# EAGLE design TripleWing (EAGLE 6.4)
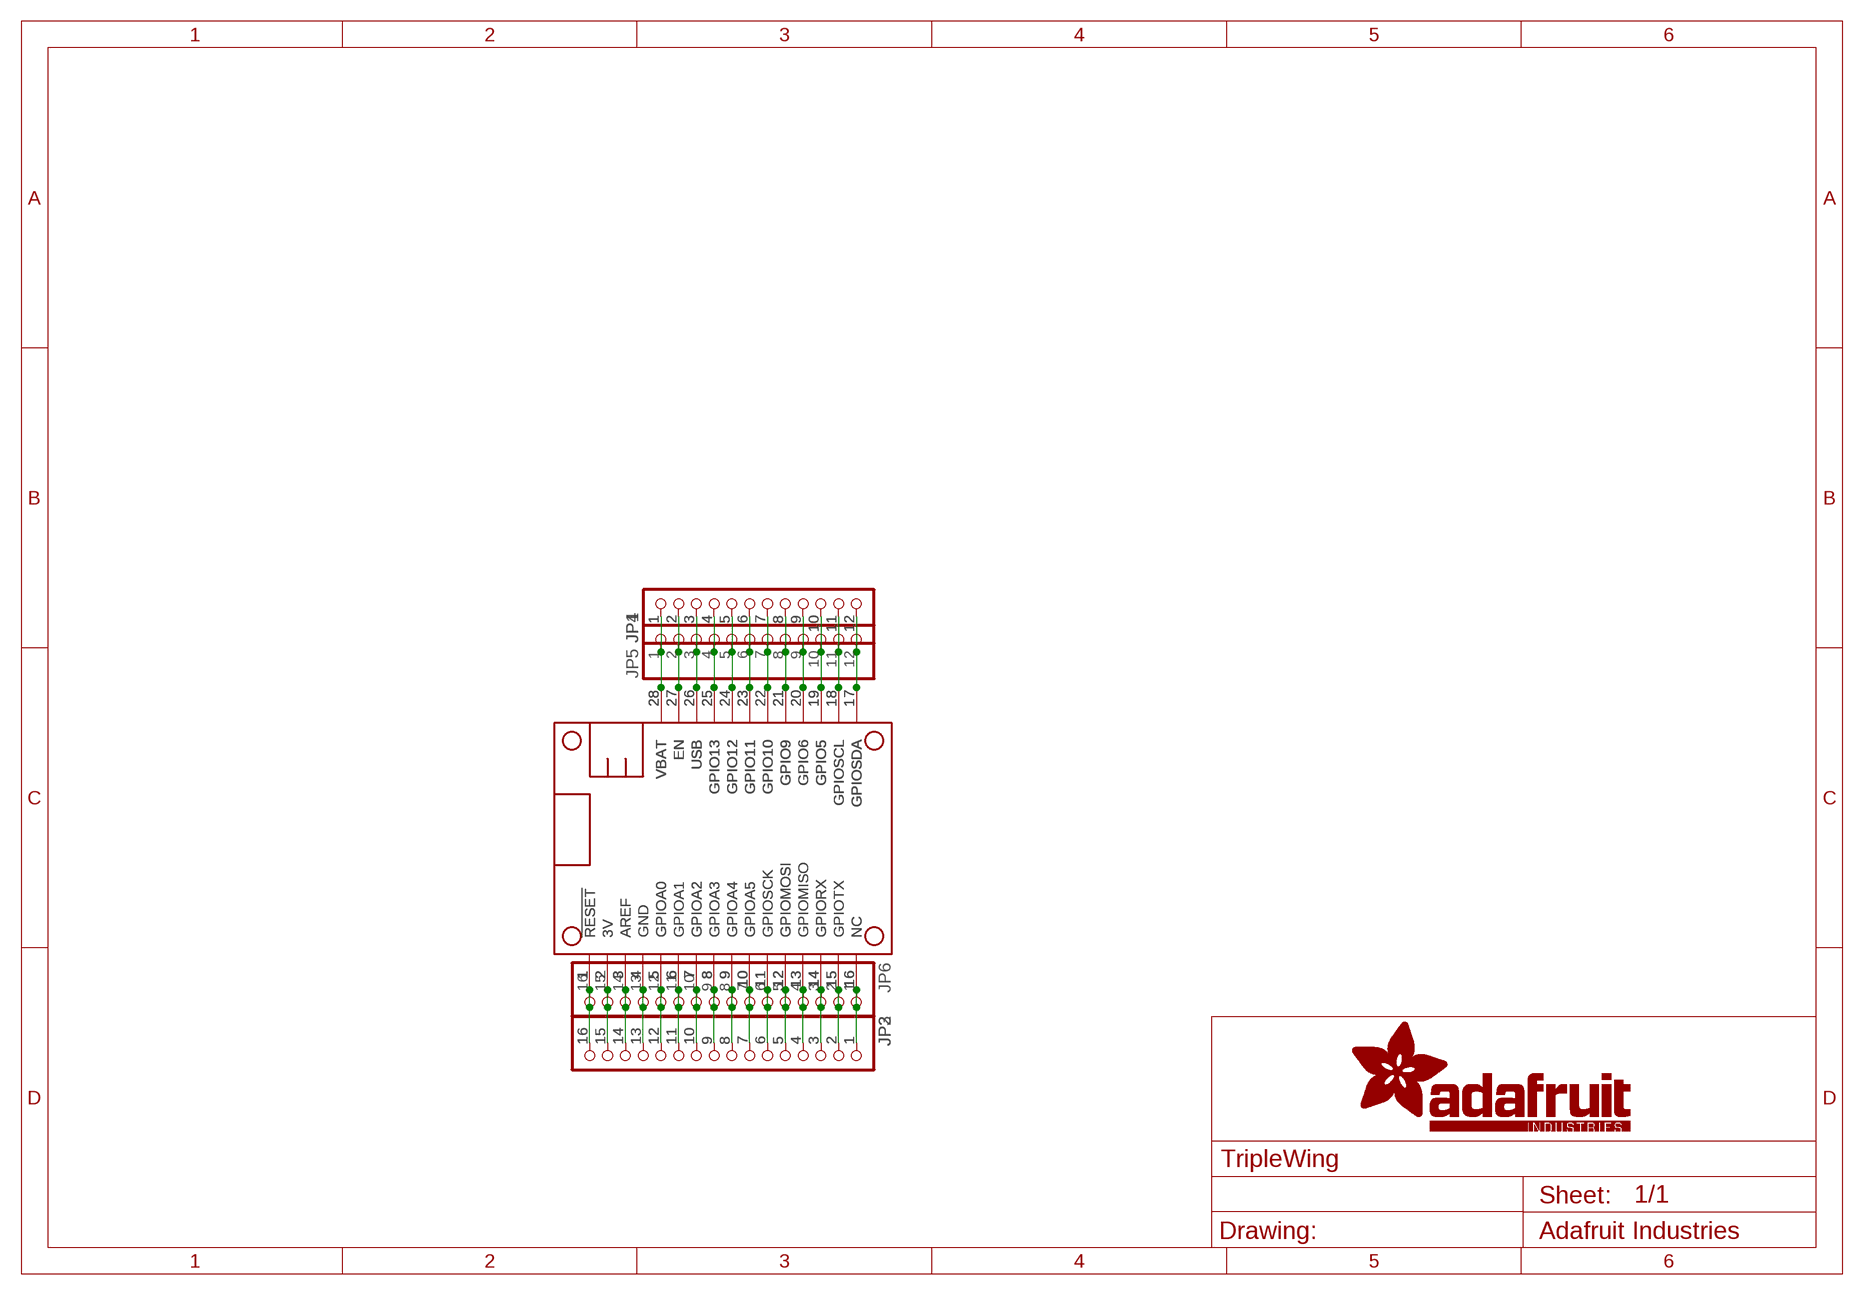
[diagram p0: schematic, sheet 1]

## Parts
JP1  HEADER-1X1276MIL  [1X12_ROUND_76MIL]
JP2  HEADER-1X16_76MIL  [1X16_ROUND_76MIL]
JP3  HEADER-1X16_76MIL  [1X16_ROUND_76MIL]
JP4  HEADER-1X1276MIL  [1X12_ROUND_76MIL]
JP5  HEADER-1X1276MIL  [1X12_ROUND_76MIL]
JP6  HEADER-1X16_76MIL  [1X16_ROUND_76MIL]
MS1  FEATHERWING_NODIM  [FEATHERWING_DIM]
MS2  FEATHERWING_NODIM  [FEATHERWING_DIM]
MS3  FEATHERWING_NODIM  [FEATHERWING_DIM]

## Nets
3V: JP2.15 JP3.15 JP6.15 MS1.2(3V) MS2.2(3V) MS3.2(3V)
A: JP2.12 JP3.12 JP6.12 MS1.5(GPIOA0) MS2.5(GPIOA0) MS3.5(GPIOA0)
AREF: JP2.14 JP3.14 JP6.14 MS1.3(AREF) MS2.3(AREF) MS3.3(AREF)
B: JP2.11 JP3.11 JP6.11 MS1.6(GPIOA1) MS2.6(GPIOA1) MS3.6(GPIOA1)
C: JP2.10 JP3.10 JP6.10 MS1.7(GPIOA2) MS2.7(GPIOA2) MS3.7(GPIOA2)
D: JP2.9 JP3.9 JP6.9 MS1.8(GPIOA3) MS2.8(GPIOA3) MS3.8(GPIOA3)
E: JP2.8 JP3.8 JP6.8 MS1.9(GPIOA4) MS2.9(GPIOA4) MS3.9(GPIOA4)
EN: JP1.2 JP4.2 JP5.2 MS1.27(EN) MS2.27(EN) MS3.27(EN)
F: JP2.7 JP3.7 JP6.7 MS1.10(GPIOA5) MS2.10(GPIOA5) MS3.10(GPIOA5)
G: JP2.1 JP3.1 JP6.1 MS1.16(NC) MS2.16(NC) MS3.16(NC)
GND: JP2.13 JP3.13 JP6.13 MS1.4(GND) MS2.4(GND) MS3.4(GND)
I: JP1.9 JP4.9 JP5.9 MS1.20(GPIO6) MS2.20(GPIO6) MS3.20(GPIO6)
J: JP1.10 JP4.10 JP5.10 MS1.19(GPIO5) MS2.19(GPIO5) MS3.19(GPIO5)
K: JP1.8 JP4.8 JP5.8 MS1.21(GPIO9) MS2.21(GPIO9) MS3.21(GPIO9)
L: JP1.7 JP4.7 JP5.7 MS1.22(GPIO10) MS2.22(GPIO10) MS3.22(GPIO10)
M: JP1.6 JP4.6 JP5.6 MS1.23(GPIO11) MS2.23(GPIO11) MS3.23(GPIO11)
MISO: JP2.4 JP3.4 JP6.4 MS1.13(GPIOMISO) MS2.13(GPIOMISO) MS3.13(GPIOMISO)
MOSI: JP2.5 JP3.5 JP6.5 MS1.12(GPIOMOSI) MS2.12(GPIOMOSI) MS3.12(GPIOMOSI)
N: JP1.5 JP4.5 JP5.5 MS1.24(GPIO12) MS2.24(GPIO12) MS3.24(GPIO12)
O: JP1.4 JP4.4 JP5.4 MS1.25(GPIO13) MS2.25(GPIO13) MS3.25(GPIO13)
RESET: JP2.16 JP3.16 JP6.16 MS1.1(!RESET) MS2.1(!RESET) MS3.1(!RESET)
RX: JP2.3 JP3.3 JP6.3 MS1.14(GPIORX) MS2.14(GPIORX) MS3.14(GPIORX)
SCK: JP2.6 JP3.6 JP6.6 MS1.11(GPIOSCK) MS2.11(GPIOSCK) MS3.11(GPIOSCK)
SCL: JP1.11 JP4.11 JP5.11 MS1.18(GPIOSCL) MS2.18(GPIOSCL) MS3.18(GPIOSCL)
SDA: JP1.12 JP4.12 JP5.12 MS1.17(GPIOSDA) MS2.17(GPIOSDA) MS3.17(GPIOSDA)
TX: JP2.2 JP3.2 JP6.2 MS1.15(GPIOTX) MS2.15(GPIOTX) MS3.15(GPIOTX)
USB: JP1.3 JP4.3 JP5.3 MS1.26(USB) MS2.26(USB) MS3.26(USB)
VBAT: JP1.1 JP4.1 JP5.1 MS1.28(VBAT) MS2.28(VBAT) MS3.28(VBAT)

## Library data of the parts
JP1 JP4 JP5 = microbuilder:HEADER-1X12
JP2 JP3 JP6 = microbuilder:HEADER-1X16: PIN HEADER
MS1-MS3 = microbuilder:FEATHERWING

## Board
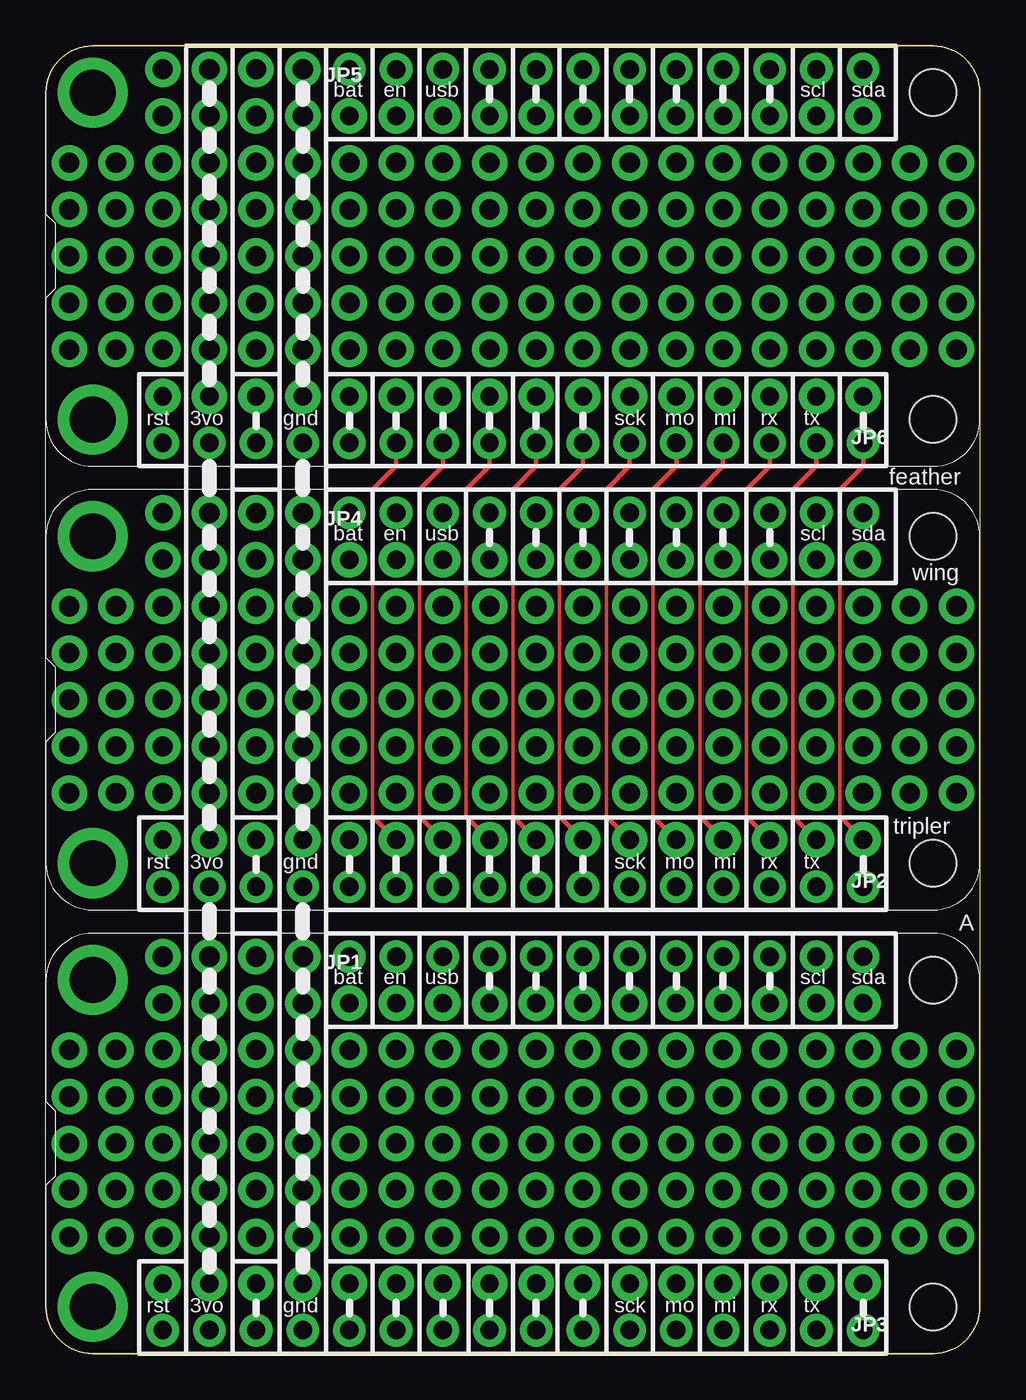
[diagram p1: board, top side]
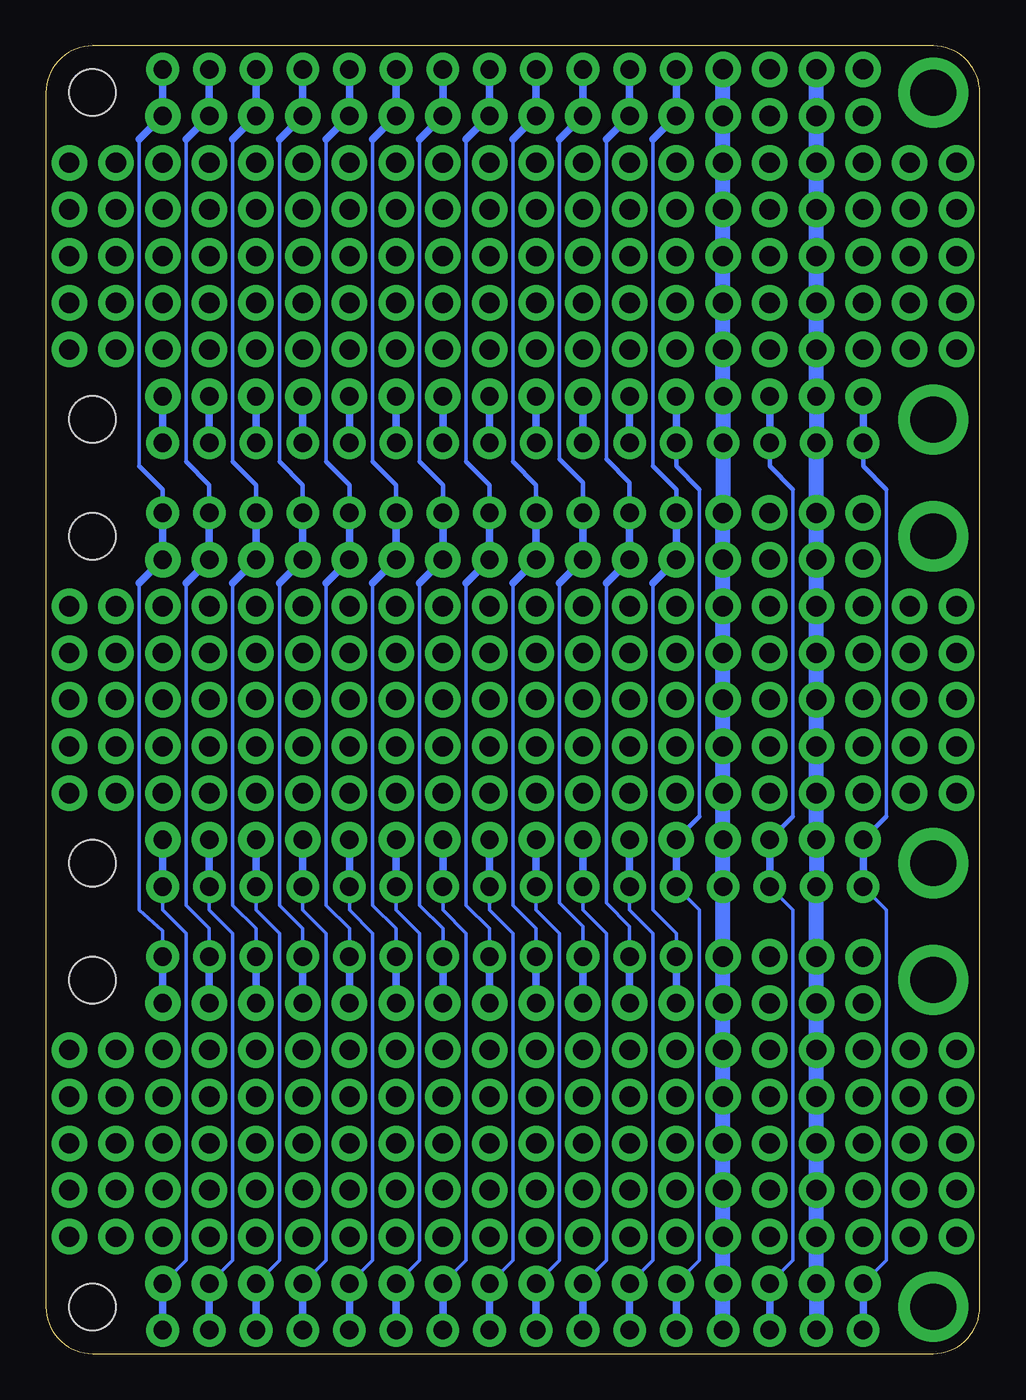
[diagram p2: board, bottom side, seen from below]

Size 50.8 x 71.12 mm. Coordinates in mm from the lower left corner, seen from the top.
Outline: 0,2.54 0,68.58 arc-90 2.54,71.12 48.26,71.12 arc-90 50.8,68.58 50.8,2.54 arc-90 48.26,0 2.54,0 arc-90 0,2.54
Copper layers (1*16): Top 0.035mm / dielectric 1.5mm / Bottom 0.035mm
Design rules "adafruit": minimum track width 8mil, minimum drill 15.5mil, track to track 8mil, track to pad 8mil, pad to pad 8mil, via to via 8mil, smd to smd 8mil, copper to edge 10mil, drill to drill 8mil, minimum pad ring 10mil, minimum via ring 8mil, stop-mask expansion 2mil, vias tented up to drill 20mil, thermal gap 10mil

### Footprints (pad centres in the part's own frame; a part is rotated, then mirrored left to right if it is on the bottom)
1X12_ROUND_76MIL = drill 1 pad 1.93: 1 -13.97,0; 2 -11.43,0; 3 -8.89,0; 4 -6.35,0; 5 -3.81,0; 6 -1.27,0; 7 1.27,0; 8 3.81,0; 9 6.35,0; 10 8.89,0; 11 11.43,0; 12 13.97,0
1X16_ROUND_76MIL = drill 1 pad 1.93: 1 -19.05,0; 2 -16.51,0; 3 -13.97,0; 4 -11.43,0; 5 -8.89,0; 6 -6.35,0; 7 -3.81,0; 8 -1.27,0; 9 1.27,0; 10 3.81,0; 11 6.35,0; 12 8.89,0; 13 11.43,0; 14 13.97,0; 15 16.51,0; 16 19.05,0
FEATHERWING_DIM = drill 1 pad 1.778: 1 6.35,1.27; 2 8.89,1.27; 3 11.43,1.27; 4 13.97,1.27; 5 16.51,1.27; 6 19.05,1.27; 7 21.59,1.27; 8 24.13,1.27; 9 26.67,1.27; 10 29.21,1.27; 11 31.75,1.27; 12 34.29,1.27; 13 36.83,1.27; 14 39.37,1.27; 15 41.91,1.27; 16 44.45,1.27; 17 44.45,21.59; 18 41.91,21.59; 19 39.37,21.59; 20 36.83,21.59; 21 34.29,21.59; 22 31.75,21.59; 23 29.21,21.59; 24 26.67,21.59; 25 24.13,21.59; 26 21.59,21.59; 27 19.05,21.59; 28 16.51,21.59 | drill 2.5 pad 3.81: P$1 2.54,20.32; P$2 2.54,2.54 | hole 2.54: 48.26,20.32; 48.26,2.54

### Placement (x,y rotation side)
JP1  30.48,19.05 0 top
JP2  25.4,27.94 180 top
JP3  25.4,3.81 180 top
JP4  30.48,43.18 0 top
JP5  30.48,67.31 0 top
JP6  25.4,52.07 180 top
MS1  0,0 0 top
MS2  0,24.13 0 top
MS3  0,48.26 0 top

### Tracks (layer width: path | path; a pad name or v marks a point on that pad's centre or on a via)
3V  (via drill 1.1 pad 1.93)
  Bottom 0.813: MS1.2 JP3.15 v8.89,6.35 v8.89,8.89 v8.89,11.43 v8.89,13.97 v8.89,16.51 v8.89,19.05 v8.89,21.59 MS2.2 JP2.15 v8.89,30.48 v8.89,33.02 v8.89,35.56 v8.89,38.1 v8.89,40.64 v8.89,43.18 v8.89,45.72 MS3.2 JP6.15 v8.89,54.61 v8.89,57.15 v8.89,59.69 v8.89,62.23 v8.89,64.77 v8.89,67.31 v8.89,69.85
A
  Bottom 0.203: JP3.12 15.24,5.08 15.24,24.13 MS2.5 | 15.24,29.21 15.24,46.99
  Bottom 0.254: JP2.12 15.24,29.21 | 15.24,46.99 16.51,48.26 MS3.5
  Bottom 0.406: JP3.12 MS1.5 | JP2.12 MS2.5 | JP6.12 MS3.5
AREF
  Bottom 0.203: JP3.14 10.16,5.08 10.16,24.13 MS2.3 | 10.16,29.21 10.16,46.99
  Bottom 0.254: JP2.14 10.16,29.21 | 10.16,46.99 11.43,48.26 MS3.3
  Bottom 0.406: JP3.14 MS1.3 | JP2.14 MS2.3 | JP6.14 MS3.3
B
  Top 0.203: 17.78,29.21 17.78,46.99
  Top 0.254: JP2.11 17.78,29.21 | 17.78,46.99 19.05,48.26 MS3.6
  Bottom 0.203: JP3.11 17.78,5.08 17.78,22.86 19.05,24.13 MS2.6
  Bottom 0.406: MS1.6 JP3.11 | JP2.11 MS2.6 | JP6.11 MS3.6
C
  Top 0.203: 20.32,29.21 20.32,46.99
  Top 0.254: JP2.10 20.32,29.21 | 20.32,46.99 21.59,48.26 MS3.7
  Bottom 0.203: JP3.10 20.32,5.08 20.32,22.86 21.59,24.13 MS2.7
  Bottom 0.406: JP3.10 MS1.7 | JP2.10 MS2.7 | JP6.10 MS3.7
D
  Top 0.203: 22.86,29.21 22.86,46.99
  Top 0.254: JP2.9 22.86,29.21 | 22.86,46.99 24.13,48.26 MS3.8
  Bottom 0.203: JP3.9 22.86,5.08 22.86,22.86 24.13,24.13 MS2.8
  Bottom 0.406: MS1.8 JP3.9 | JP2.9 MS2.8 | JP6.9 MS3.8
E
  Top 0.203: 25.4,29.21 25.4,46.99
  Top 0.254: JP2.8 25.4,29.21 | 25.4,46.99 26.67,48.26 MS3.9
  Bottom 0.203: JP3.8 25.4,5.08 25.4,22.86 26.67,24.13 MS2.9
  Bottom 0.406: JP3.8 MS1.9 | JP2.8 MS2.9 | JP6.8 MS3.9
EN
  Bottom 0.203: MS1.27 19.05,23.24 20.32,24.51 20.32,41.91 | 20.32,48.64 20.32,66.04
  Bottom 0.254: 20.32,48.64 19.05,47.37 MS2.27
  Bottom 0.406: JP1.2 MS1.27 | MS2.27 JP4.2 20.32,41.91 | 20.32,66.04 JP5.2 MS3.27
F
  Top 0.203: 27.94,29.21 27.94,46.99
  Top 0.254: JP2.7 27.94,29.21 | 27.94,46.99 29.21,48.26 MS3.10
  Bottom 0.203: JP3.7 27.94,5.08 27.94,22.86 29.21,24.13 MS2.10
  Bottom 0.406: MS1.10 JP3.7 | JP2.7 MS2.10 | JP6.7 MS3.10
G
  Top 0.203: 43.18,29.21 43.18,46.99
  Top 0.254: JP2.1 43.18,29.21 | 43.18,46.99 44.45,48.26 MS3.16
  Bottom 0.203: JP3.1 43.18,5.08 43.18,22.86 44.45,24.13 MS2.16
  Bottom 0.406: JP3.1 MS1.16 | JP2.1 MS2.16 | JP6.1 MS3.16
GND  (via drill 1.1 pad 1.93)
  Bottom 0.813: MS1.4 JP3.13 v13.97,6.35 v13.97,8.89 v13.97,11.43 v13.97,13.97 v13.97,16.51 v13.97,19.05 v13.97,21.59 MS2.4 JP2.13 v13.97,30.48 v13.97,33.02 v13.97,35.56 v13.97,38.1 v13.97,40.64 v13.97,43.18 v13.97,45.72 MS3.4 JP6.13 v13.97,54.61 v13.97,57.15 v13.97,59.69 v13.97,62.23 v13.97,64.77 v13.97,67.31 v13.97,69.85
I
  Bottom 0.203: MS1.20 36.83,23.11 38.1,24.38 38.1,41.91 | 38.1,48.51 38.1,66.04
  Bottom 0.254: 38.1,48.51 36.83,47.24 MS2.20
  Bottom 0.406: MS1.20 JP1.9 | MS2.20 JP4.9 38.1,41.91 | 38.1,66.04 JP5.9 MS3.20
J
  Bottom 0.203: 39.37,21.08 MS1.19 39.37,23.11 40.64,24.38 40.64,41.91 | 40.64,48.51 40.64,66.04
  Bottom 0.254: 40.64,48.51 39.37,47.24 MS2.19
  Bottom 0.406: JP1.10 39.37,21.08 | MS2.19 JP4.10 40.64,41.91 | 40.64,66.04 JP5.10 MS3.19
K
  Bottom 0.203: MS1.21 34.29,23.11 35.56,24.38 35.56,41.91 | 35.56,48.51 35.56,66.04
  Bottom 0.254: 35.56,48.51 34.29,47.24 MS2.21
  Bottom 0.406: JP1.8 MS1.21 | MS2.21 JP4.8 35.56,41.91 | 35.56,66.04 JP5.8 MS3.21
L
  Bottom 0.203: MS1.22 31.75,23.11 33.02,24.38 33.02,41.91 | 33.02,48.51 33.02,66.04
  Bottom 0.254: 33.02,48.51 31.75,47.24 MS2.22
  Bottom 0.406: MS1.22 JP1.7 | MS2.22 JP4.7 33.02,41.91 | 33.02,66.04 JP5.7 MS3.22
M
  Bottom 0.203: MS1.23 29.21,23.11 30.48,24.38 30.48,41.91 | 30.48,48.51 30.48,66.04
  Bottom 0.254: 30.48,48.51 29.21,47.24 MS2.23
  Bottom 0.406: JP1.6 MS1.23 | MS2.23 JP4.6 30.48,41.91 | 30.48,66.04 JP5.6 MS3.23
MISO
  Top 0.203: 35.56,29.21 35.56,46.99
  Top 0.254: JP2.4 35.56,29.21 | 35.56,46.99 36.83,48.26 MS3.13
  Bottom 0.203: JP3.4 35.56,5.08 35.56,22.86 36.83,24.13 MS2.13
  Bottom 0.406: JP3.4 MS1.13 | JP2.4 MS2.13 | JP6.4 MS3.13
MOSI
  Top 0.203: 33.02,29.21 33.02,46.99
  Top 0.254: JP2.5 33.02,29.21 | 33.02,46.99 34.29,48.26 MS3.12
  Bottom 0.203: JP3.5 33.02,5.08 33.02,22.86 34.29,24.13 MS2.12
  Bottom 0.406: MS1.12 JP3.5 | JP2.5 MS2.12 | JP6.5 MS3.12
N
  Bottom 0.203: MS1.24 26.67,23.11 27.94,24.38 27.94,41.91 | 27.94,48.51 27.94,66.04
  Bottom 0.254: 27.94,48.51 26.67,47.24 MS2.24
  Bottom 0.406: MS1.24 JP1.5 | MS2.24 JP4.5 27.94,41.91 | 27.94,66.04 JP5.5 MS3.24
N$1  (via drill 1.1 pad 1.93)
  other vias: 44.45,54.61
N$2  (via drill 1.1 pad 1.93)
  other vias: 44.45,57.15
N$3  (via drill 1.1 pad 1.93)
  other vias: 44.45,59.69
N$4  (via drill 1.1 pad 1.93)
  other vias: 44.45,62.23
N$5  (via drill 1.1 pad 1.93)
  other vias: 44.45,64.77
N$6  (via drill 1.1 pad 1.93)
  other vias: 41.91,64.77
N$7  (via drill 1.1 pad 1.93)
  other vias: 41.91,62.23
N$8  (via drill 1.1 pad 1.93)
  other vias: 41.91,59.69
N$9  (via drill 1.1 pad 1.93)
  other vias: 41.91,57.15
N$10  (via drill 1.1 pad 1.93)
  other vias: 41.91,54.61
N$11  (via drill 1.1 pad 1.93)
  other vias: 46.99,54.61
N$12  (via drill 1.1 pad 1.93)
  other vias: 46.99,57.15
N$13  (via drill 1.1 pad 1.93)
  other vias: 46.99,59.69
N$14  (via drill 1.1 pad 1.93)
  other vias: 46.99,62.23
N$15  (via drill 1.1 pad 1.93)
  other vias: 46.99,64.77
N$16  (via drill 1.1 pad 1.93)
  other vias: 44.45,30.48
N$17  (via drill 1.1 pad 1.93)
  other vias: 49.53,64.77
N$18  (via drill 1.1 pad 1.93)
  other vias: 49.53,62.23
N$19  (via drill 1.1 pad 1.93)
  other vias: 49.53,59.69
N$20  (via drill 1.1 pad 1.93)
  other vias: 49.53,57.15
N$21  (via drill 1.1 pad 1.93)
  other vias: 49.53,54.61
N$22  (via drill 1.1 pad 1.93)
  other vias: 39.37,54.61
N$23  (via drill 1.1 pad 1.93)
  other vias: 39.37,57.15
N$24  (via drill 1.1 pad 1.93)
  other vias: 39.37,59.69
N$25  (via drill 1.1 pad 1.93)
  other vias: 39.37,62.23
N$26  (via drill 1.1 pad 1.93)
  other vias: 6.35,6.35
N$27  (via drill 1.1 pad 1.93)
  other vias: 44.45,33.02
N$28  (via drill 1.1 pad 1.93)
  other vias: 11.43,6.35
N$29  (via drill 1.1 pad 1.93)
  other vias: 44.45,35.56
N$30  (via drill 1.1 pad 1.93)
  other vias: 44.45,38.1
N$31  (via drill 1.1 pad 1.93)
  other vias: 11.43,8.89
N$32  (via drill 1.1 pad 1.93)
  other vias: 44.45,40.64
N$33  (via drill 1.1 pad 1.93)
  other vias: 6.35,8.89
N$34  (via drill 1.1 pad 1.93)
  other vias: 6.35,11.43
N$35  (via drill 1.1 pad 1.93)
  other vias: 41.91,40.64
N$36  (via drill 1.1 pad 1.93)
  other vias: 3.81,6.35
N$37  (via drill 1.1 pad 1.93)
  other vias: 1.27,6.35
N$38  (via drill 1.1 pad 1.93)
  other vias: 1.27,8.89
N$39  (via drill 1.1 pad 1.93)
  other vias: 3.81,8.89
N$40  (via drill 1.1 pad 1.93)
  other vias: 3.81,11.43
N$41  (via drill 1.1 pad 1.93)
  other vias: 1.27,11.43
N$42  (via drill 1.1 pad 1.93)
  other vias: 1.27,13.97
N$43  (via drill 1.1 pad 1.93)
  other vias: 3.81,13.97
N$44  (via drill 1.1 pad 1.93)
  other vias: 6.35,13.97
N$45  (via drill 1.1 pad 1.93)
  other vias: 41.91,38.1
N$46  (via drill 1.1 pad 1.93)
  other vias: 11.43,13.97
N$47  (via drill 1.1 pad 1.93)
  other vias: 11.43,11.43
N$48  (via drill 1.1 pad 1.93)
  other vias: 41.91,35.56
N$49  (via drill 1.1 pad 1.93)
  other vias: 41.91,33.02
N$50  (via drill 1.1 pad 1.93)
  other vias: 1.27,16.51
N$51  (via drill 1.1 pad 1.93)
  other vias: 3.81,16.51
N$52  (via drill 1.1 pad 1.93)
  other vias: 6.35,16.51
N$53  (via drill 1.1 pad 1.93)
  other vias: 41.91,30.48
N$54  (via drill 1.1 pad 1.93)
  other vias: 11.43,16.51
N$55  (via drill 1.1 pad 1.93)
  other vias: 46.99,30.48
N$56  (via drill 1.1 pad 1.93)
  other vias: 46.99,33.02
N$57  (via drill 1.1 pad 1.93)
  other vias: 46.99,35.56
N$58  (via drill 1.1 pad 1.93)
  other vias: 11.43,21.59
N$59  (via drill 1.1 pad 1.93)
  other vias: 11.43,19.05
N$60  (via drill 1.1 pad 1.93)
  other vias: 46.99,38.1
N$61  (via drill 1.1 pad 1.93)
  other vias: 46.99,40.64
N$62  (via drill 1.1 pad 1.93)
  other vias: 6.35,21.59
N$63  (via drill 1.1 pad 1.93)
  other vias: 6.35,19.05
N$64  (via drill 1.1 pad 1.93)
  other vias: 16.51,6.35
N$65  (via drill 1.1 pad 1.93)
  other vias: 16.51,8.89
N$66  (via drill 1.1 pad 1.93)
  other vias: 16.51,11.43
N$67  (via drill 1.1 pad 1.93)
  other vias: 16.51,13.97
N$68  (via drill 1.1 pad 1.93)
  other vias: 16.51,16.51
N$69  (via drill 1.1 pad 1.93)
  other vias: 19.05,16.51
N$70  (via drill 1.1 pad 1.93)
  other vias: 19.05,13.97
N$71  (via drill 1.1 pad 1.93)
  other vias: 19.05,11.43
N$72  (via drill 1.1 pad 1.93)
  other vias: 19.05,8.89
N$73  (via drill 1.1 pad 1.93)
  other vias: 19.05,6.35
N$74  (via drill 1.1 pad 1.93)
  other vias: 21.59,6.35
N$75  (via drill 1.1 pad 1.93)
  other vias: 21.59,8.89
N$76  (via drill 1.1 pad 1.93)
  other vias: 21.59,11.43
N$77  (via drill 1.1 pad 1.93)
  other vias: 21.59,13.97
N$78  (via drill 1.1 pad 1.93)
  other vias: 21.59,16.51
N$79  (via drill 1.1 pad 1.93)
  other vias: 24.13,16.51
N$80  (via drill 1.1 pad 1.93)
  other vias: 24.13,13.97
N$81  (via drill 1.1 pad 1.93)
  other vias: 24.13,11.43
N$82  (via drill 1.1 pad 1.93)
  other vias: 24.13,8.89
N$83  (via drill 1.1 pad 1.93)
  other vias: 24.13,6.35
N$84  (via drill 1.1 pad 1.93)
  other vias: 26.67,6.35
N$85  (via drill 1.1 pad 1.93)
  other vias: 26.67,8.89
N$86  (via drill 1.1 pad 1.93)
  other vias: 26.67,11.43
N$87  (via drill 1.1 pad 1.93)
  other vias: 26.67,13.97
N$88  (via drill 1.1 pad 1.93)
  other vias: 26.67,16.51
N$89  (via drill 1.1 pad 1.93)
  other vias: 29.21,16.51
N$90  (via drill 1.1 pad 1.93)
  other vias: 29.21,13.97
N$91  (via drill 1.1 pad 1.93)
  other vias: 29.21,11.43
N$92  (via drill 1.1 pad 1.93)
  other vias: 29.21,8.89
N$93  (via drill 1.1 pad 1.93)
  other vias: 29.21,6.35
N$94  (via drill 1.1 pad 1.93)
  other vias: 31.75,6.35
N$95  (via drill 1.1 pad 1.93)
  other vias: 34.29,6.35
N$96  (via drill 1.1 pad 1.93)
  other vias: 36.83,6.35
N$97  (via drill 1.1 pad 1.93)
  other vias: 39.37,6.35
N$98  (via drill 1.1 pad 1.93)
  other vias: 41.91,6.35
N$99  (via drill 1.1 pad 1.93)
  other vias: 41.91,8.89
N$100  (via drill 1.1 pad 1.93)
  other vias: 41.91,11.43
N$101  (via drill 1.1 pad 1.93)
  other vias: 41.91,13.97
N$102  (via drill 1.1 pad 1.93)
  other vias: 41.91,16.51
N$103  (via drill 1.1 pad 1.93)
  other vias: 39.37,16.51
N$104  (via drill 1.1 pad 1.93)
  other vias: 39.37,13.97
N$105  (via drill 1.1 pad 1.93)
  other vias: 39.37,11.43
N$106  (via drill 1.1 pad 1.93)
  other vias: 39.37,8.89
N$107  (via drill 1.1 pad 1.93)
  other vias: 36.83,8.89
N$108  (via drill 1.1 pad 1.93)
  other vias: 36.83,11.43
N$109  (via drill 1.1 pad 1.93)
  other vias: 36.83,13.97
N$110  (via drill 1.1 pad 1.93)
  other vias: 36.83,16.51
N$111  (via drill 1.1 pad 1.93)
  other vias: 34.29,16.51
N$112  (via drill 1.1 pad 1.93)
  other vias: 34.29,13.97
N$113  (via drill 1.1 pad 1.93)
  other vias: 34.29,11.43
N$114  (via drill 1.1 pad 1.93)
  other vias: 34.29,8.89
N$115  (via drill 1.1 pad 1.93)
  other vias: 31.75,8.89
N$116  (via drill 1.1 pad 1.93)
  other vias: 31.75,11.43
N$117  (via drill 1.1 pad 1.93)
  other vias: 31.75,13.97
N$118  (via drill 1.1 pad 1.93)
  other vias: 31.75,16.51
N$119  (via drill 1.1 pad 1.93)
  other vias: 44.45,16.51
N$120  (via drill 1.1 pad 1.93)
  other vias: 44.45,13.97
N$121  (via drill 1.1 pad 1.93)
  other vias: 44.45,11.43
N$122  (via drill 1.1 pad 1.93)
  other vias: 44.45,8.89
N$123  (via drill 1.1 pad 1.93)
  other vias: 44.45,6.35
N$124  (via drill 1.1 pad 1.93)
  other vias: 46.99,6.35
N$125  (via drill 1.1 pad 1.93)
  other vias: 49.53,6.35
N$126  (via drill 1.1 pad 1.93)
  other vias: 49.53,8.89
N$127  (via drill 1.1 pad 1.93)
  other vias: 46.99,8.89
N$128  (via drill 1.1 pad 1.93)
  other vias: 46.99,11.43
N$129  (via drill 1.1 pad 1.93)
  other vias: 49.53,11.43
N$130  (via drill 1.1 pad 1.93)
  other vias: 49.53,13.97
N$131  (via drill 1.1 pad 1.93)
  other vias: 46.99,13.97
N$132  (via drill 1.1 pad 1.93)
  other vias: 46.99,16.51
N$133  (via drill 1.1 pad 1.93)
  other vias: 49.53,16.51
N$134  (via drill 1.1 pad 1.93)
  other vias: 49.53,40.64
N$135  (via drill 1.1 pad 1.93)
  other vias: 49.53,38.1
N$136  (via drill 1.1 pad 1.93)
  other vias: 49.53,35.56
N$137  (via drill 1.1 pad 1.93)
  other vias: 49.53,33.02
N$138  (via drill 1.1 pad 1.93)
  other vias: 49.53,30.48
N$139  (via drill 1.1 pad 1.93)
  other vias: 39.37,30.48
N$140  (via drill 1.1 pad 1.93)
  other vias: 39.37,33.02
N$141  (via drill 1.1 pad 1.93)
  other vias: 39.37,35.56
N$142  (via drill 1.1 pad 1.93)
  other vias: 39.37,38.1
N$143  (via drill 1.1 pad 1.93)
  other vias: 39.37,40.64
N$144  (via drill 1.1 pad 1.93)
  other vias: 36.83,40.64
N$145  (via drill 1.1 pad 1.93)
  other vias: 36.83,38.1
N$146  (via drill 1.1 pad 1.93)
  other vias: 36.83,35.56
N$147  (via drill 1.1 pad 1.93)
  other vias: 36.83,33.02
N$148  (via drill 1.1 pad 1.93)
  other vias: 36.83,30.48
N$149  (via drill 1.1 pad 1.93)
  other vias: 34.29,30.48
N$150  (via drill 1.1 pad 1.93)
  other vias: 34.29,33.02
N$151  (via drill 1.1 pad 1.93)
  other vias: 34.29,35.56
N$152  (via drill 1.1 pad 1.93)
  other vias: 34.29,38.1
N$153  (via drill 1.1 pad 1.93)
  other vias: 34.29,40.64
N$154  (via drill 1.1 pad 1.93)
  other vias: 31.75,40.64
N$155  (via drill 1.1 pad 1.93)
  other vias: 31.75,38.1
N$156  (via drill 1.1 pad 1.93)
  other vias: 31.75,35.56
N$157  (via drill 1.1 pad 1.93)
  other vias: 31.75,33.02
N$158  (via drill 1.1 pad 1.93)
  other vias: 31.75,30.48
N$159  (via drill 1.1 pad 1.93)
  other vias: 29.21,30.48
N$160  (via drill 1.1 pad 1.93)
  other vias: 29.21,33.02
N$161  (via drill 1.1 pad 1.93)
  other vias: 29.21,35.56
N$162  (via drill 1.1 pad 1.93)
  other vias: 29.21,38.1
N$163  (via drill 1.1 pad 1.93)
  other vias: 29.21,40.64
N$164  (via drill 1.1 pad 1.93)
  other vias: 26.67,40.64
N$165  (via drill 1.1 pad 1.93)
  other vias: 26.67,38.1
N$166  (via drill 1.1 pad 1.93)
  other vias: 26.67,35.56
N$167  (via drill 1.1 pad 1.93)
  other vias: 26.67,33.02
N$168  (via drill 1.1 pad 1.93)
  other vias: 26.67,30.48
N$169  (via drill 1.1 pad 1.93)
  other vias: 24.13,30.48
N$170  (via drill 1.1 pad 1.93)
  other vias: 24.13,33.02
N$171  (via drill 1.1 pad 1.93)
  other vias: 24.13,35.56
N$172  (via drill 1.1 pad 1.93)
  other vias: 24.13,38.1
N$173  (via drill 1.1 pad 1.93)
  other vias: 24.13,40.64
N$174  (via drill 1.1 pad 1.93)
  other vias: 21.59,40.64
N$175  (via drill 1.1 pad 1.93)
  other vias: 21.59,38.1
N$176  (via drill 1.1 pad 1.93)
  other vias: 21.59,35.56
N$177  (via drill 1.1 pad 1.93)
  other vias: 21.59,33.02
N$178  (via drill 1.1 pad 1.93)
  other vias: 21.59,30.48
N$179  (via drill 1.1 pad 1.93)
  other vias: 19.05,30.48
N$180  (via drill 1.1 pad 1.93)
  other vias: 19.05,33.02
N$181  (via drill 1.1 pad 1.93)
  other vias: 19.05,35.56
N$182  (via drill 1.1 pad 1.93)
  other vias: 19.05,38.1
N$183  (via drill 1.1 pad 1.93)
  other vias: 19.05,40.64
N$184  (via drill 1.1 pad 1.93)
  other vias: 16.51,40.64
N$185  (via drill 1.1 pad 1.93)
  other vias: 16.51,38.1
N$186  (via drill 1.1 pad 1.93)
  other vias: 16.51,35.56
N$187  (via drill 1.1 pad 1.93)
  other vias: 16.51,33.02
N$188  (via drill 1.1 pad 1.93)
  other vias: 16.51,30.48
N$189  (via drill 1.1 pad 1.93)
  other vias: 11.43,30.48
N$190  (via drill 1.1 pad 1.93)
  other vias: 11.43,33.02
N$191  (via drill 1.1 pad 1.93)
  other vias: 11.43,35.56
N$192  (via drill 1.1 pad 1.93)
  other vias: 11.43,38.1
N$193  (via drill 1.1 pad 1.93)
  other vias: 11.43,40.64
N$194  (via drill 1.1 pad 1.93)
  other vias: 11.43,43.18
N$195  (via drill 1.1 pad 1.93)
  other vias: 11.43,45.72
N$196  (via drill 1.1 pad 1.93)
  other vias: 6.35,30.48
N$197  (via drill 1.1 pad 1.93)
  other vias: 6.35,33.02
N$198  (via drill 1.1 pad 1.93)
  other vias: 6.35,35.56
N$199  (via drill 1.1 pad 1.93)
  other vias: 6.35,38.1
N$200  (via drill 1.1 pad 1.93)
  other vias: 6.35,40.64
N$201  (via drill 1.1 pad 1.93)
  other vias: 6.35,43.18
N$202  (via drill 1.1 pad 1.93)
  other vias: 6.35,45.72
N$203  (via drill 1.1 pad 1.93)
  other vias: 3.81,40.64
N$204  (via drill 1.1 pad 1.93)
  other vias: 1.27,40.64
N$205  (via drill 1.1 pad 1.93)
  other vias: 1.27,38.1
N$206  (via drill 1.1 pad 1.93)
  other vias: 3.81,38.1
N$207  (via drill 1.1 pad 1.93)
  other vias: 3.81,35.56
N$208  (via drill 1.1 pad 1.93)
  other vias: 1.27,35.56
N$209  (via drill 1.1 pad 1.93)
  other vias: 1.27,33.02
N$210  (via drill 1.1 pad 1.93)
  other vias: 3.81,33.02
N$211  (via drill 1.1 pad 1.93)
  other vias: 3.81,30.48
N$212  (via drill 1.1 pad 1.93)
  other vias: 1.27,30.48
N$213  (via drill 1.1 pad 1.93)
  other vias: 39.37,64.77
N$214  (via drill 1.1 pad 1.93)
  other vias: 36.83,64.77
N$215  (via drill 1.1 pad 1.93)
  other vias: 36.83,62.23
N$216  (via drill 1.1 pad 1.93)
  other vias: 36.83,59.69
N$217  (via drill 1.1 pad 1.93)
  other vias: 36.83,57.15
N$218  (via drill 1.1 pad 1.93)
  other vias: 36.83,54.61
N$219  (via drill 1.1 pad 1.93)
  other vias: 34.29,54.61
N$220  (via drill 1.1 pad 1.93)
  other vias: 34.29,57.15
N$221  (via drill 1.1 pad 1.93)
  other vias: 34.29,59.69
N$222  (via drill 1.1 pad 1.93)
  other vias: 34.29,62.23
N$223  (via drill 1.1 pad 1.93)
  other vias: 34.29,64.77
N$224  (via drill 1.1 pad 1.93)
  other vias: 31.75,64.77
N$225  (via drill 1.1 pad 1.93)
  other vias: 31.75,62.23
N$226  (via drill 1.1 pad 1.93)
  other vias: 31.75,59.69
N$227  (via drill 1.1 pad 1.93)
  other vias: 31.75,57.15
N$228  (via drill 1.1 pad 1.93)
  other vias: 31.75,54.61
N$229  (via drill 1.1 pad 1.93)
  other vias: 29.21,54.61
N$230  (via drill 1.1 pad 1.93)
  other vias: 29.21,57.15
N$231  (via drill 1.1 pad 1.93)
  other vias: 29.21,59.69
N$232  (via drill 1.1 pad 1.93)
  other vias: 29.21,62.23
N$233  (via drill 1.1 pad 1.93)
  other vias: 29.21,64.77
N$234  (via drill 1.1 pad 1.93)
  other vias: 26.67,64.77
N$235  (via drill 1.1 pad 1.93)
  other vias: 26.67,62.23
N$236  (via drill 1.1 pad 1.93)
  other vias: 26.67,59.69
N$237  (via drill 1.1 pad 1.93)
  other vias: 26.67,57.15
N$238  (via drill 1.1 pad 1.93)
  other vias: 26.67,54.61
N$239  (via drill 1.1 pad 1.93)
  other vias: 24.13,54.61
N$240  (via drill 1.1 pad 1.93)
  other vias: 24.13,57.15
N$241  (via drill 1.1 pad 1.93)
  other vias: 24.13,59.69
N$242  (via drill 1.1 pad 1.93)
  other vias: 24.13,62.23
N$243  (via drill 1.1 pad 1.93)
  other vias: 24.13,64.77
N$244  (via drill 1.1 pad 1.93)
  other vias: 21.59,64.77
N$245  (via drill 1.1 pad 1.93)
  other vias: 21.59,62.23
N$246  (via drill 1.1 pad 1.93)
  other vias: 21.59,59.69
N$247  (via drill 1.1 pad 1.93)
  other vias: 21.59,57.15
N$248  (via drill 1.1 pad 1.93)
  other vias: 21.59,54.61
N$249  (via drill 1.1 pad 1.93)
  other vias: 19.05,54.61
N$250  (via drill 1.1 pad 1.93)
  other vias: 19.05,57.15
N$251  (via drill 1.1 pad 1.93)
  other vias: 19.05,59.69
N$252  (via drill 1.1 pad 1.93)
  other vias: 19.05,62.23
N$253  (via drill 1.1 pad 1.93)
  other vias: 19.05,64.77
N$254  (via drill 1.1 pad 1.93)
  other vias: 16.51,64.77
N$255  (via drill 1.1 pad 1.93)
  other vias: 16.51,62.23
N$256  (via drill 1.1 pad 1.93)
  other vias: 16.51,59.69
N$257  (via drill 1.1 pad 1.93)
  other vias: 16.51,57.15
N$258  (via drill 1.1 pad 1.93)
  other vias: 16.51,54.61
N$259  (via drill 1.1 pad 1.93)
  other vias: 11.43,54.61
N$260  (via drill 1.1 pad 1.93)
  other vias: 11.43,57.15
N$261  (via drill 1.1 pad 1.93)
  other vias: 11.43,59.69
N$262  (via drill 1.1 pad 1.93)
  other vias: 11.43,62.23
N$263  (via drill 1.1 pad 1.93)
  other vias: 11.43,64.77
N$264  (via drill 1.1 pad 1.93)
  other vias: 11.43,67.31
N$265  (via drill 1.1 pad 1.93)
  other vias: 11.43,69.85
N$266  (via drill 1.1 pad 1.93)
  other vias: 6.35,54.61
N$267  (via drill 1.1 pad 1.93)
  other vias: 6.35,57.15
N$268  (via drill 1.1 pad 1.93)
  other vias: 6.35,59.69
N$269  (via drill 1.1 pad 1.93)
  other vias: 6.35,62.23
N$270  (via drill 1.1 pad 1.93)
  other vias: 6.35,64.77
N$271  (via drill 1.1 pad 1.93)
  other vias: 6.35,67.31
N$272  (via drill 1.1 pad 1.93)
  other vias: 6.35,69.85
N$273  (via drill 1.1 pad 1.93)
  other vias: 3.81,64.77
N$274  (via drill 1.1 pad 1.93)
  other vias: 1.27,64.77
N$275  (via drill 1.1 pad 1.93)
  other vias: 1.27,62.23
N$276  (via drill 1.1 pad 1.93)
  other vias: 3.81,62.23
N$277  (via drill 1.1 pad 1.93)
  other vias: 3.81,59.69
N$278  (via drill 1.1 pad 1.93)
  other vias: 1.27,59.69
N$279  (via drill 1.1 pad 1.93)
  other vias: 1.27,57.15
N$280  (via drill 1.1 pad 1.93)
  other vias: 3.81,57.15
N$281  (via drill 1.1 pad 1.93)
  other vias: 3.81,54.61
N$282  (via drill 1.1 pad 1.93)
  other vias: 1.27,54.61
O
  Bottom 0.203: MS1.25 24.13,23.11 25.4,24.38 25.4,41.91 | 25.4,48.51 25.4,66.04
  Bottom 0.254: 25.4,48.51 24.13,47.24 MS2.25
  Bottom 0.406: JP1.4 MS1.25 | MS2.25 JP4.4 25.4,41.91 | 25.4,66.04 JP5.4 MS3.25
RESET
  Bottom 0.203: JP3.16 5.08,5.08 5.08,24.13 MS2.1 | 5.08,29.21 5.08,46.99
  Bottom 0.254: JP2.16 5.08,29.21 | 5.08,46.99 6.35,48.26 MS3.1
  Bottom 0.406: MS1.1 JP3.16 | JP2.16 MS2.1 | JP6.16 MS3.1
RX
  Top 0.203: 38.1,29.21 38.1,46.99
  Top 0.254: JP2.3 38.1,29.21 | 38.1,46.99 39.37,48.26 MS3.14
  Bottom 0.203: JP3.3 38.1,5.08 38.1,22.86 39.37,24.13 MS2.14
  Bottom 0.406: JP3.3 MS1.14 | JP2.3 MS2.14 | JP6.3 MS3.14
SCK
  Top 0.203: 30.48,29.21 30.48,46.99
  Top 0.254: JP2.6 30.48,29.21 | 30.48,46.99 31.75,48.26 MS3.11
  Bottom 0.203: JP3.6 30.48,5.08 30.48,22.86 31.75,24.13 MS2.11
  Bottom 0.406: JP3.6 MS1.11 | JP2.6 MS2.11 | JP6.6 MS3.11
SCL
  Bottom 0.203: MS1.18 41.91,23.11 43.18,24.38 43.18,41.91 | 43.18,48.51 43.18,66.04
  Bottom 0.254: 43.18,48.51 41.91,47.24 MS2.18
  Bottom 0.406: MS1.18 JP1.11 | MS2.18 JP4.11 43.18,41.91 | 43.18,66.04 JP5.11 MS3.18
SDA
  Bottom 0.203: MS1.17 44.45,22.99 45.72,24.13 45.72,41.91 | 45.72,48.26 45.72,66.04
  Bottom 0.254: 45.72,48.26 44.45,46.99 MS2.17
  Bottom 0.406: MS1.17 JP1.12 | MS2.17 JP4.12 45.72,41.91 | 45.72,66.04 JP5.12 MS3.17
TX
  Top 0.203: 40.64,29.21 40.64,46.99
  Top 0.254: JP2.2 40.64,29.21 | 40.64,46.99 41.91,48.26 MS3.15
  Bottom 0.203: JP3.2 40.64,5.08 40.64,22.86 41.91,24.13 MS2.15
  Bottom 0.406: MS1.15 JP3.2 | JP2.2 MS2.15 | JP6.2 MS3.15
USB
  Bottom 0.203: MS1.26 21.59,23.24 22.86,24.51 22.86,41.91 | 22.86,48.64 22.86,66.04
  Bottom 0.254: 22.86,48.64 21.59,47.37 MS2.26
  Bottom 0.406: MS1.26 JP1.3 | MS2.26 JP4.3 22.86,41.91 | 22.86,66.04 JP5.3 MS3.26
VBAT
  Bottom 0.203: MS1.28 16.51,22.86 17.78,24.13 17.78,41.91 | 17.78,48.26 17.78,66.04
  Bottom 0.254: 17.78,48.26 16.51,46.99 MS2.28
  Bottom 0.406: MS1.28 JP1.1 | MS2.28 JP4.1 17.78,41.91 | 17.78,66.04 JP5.1 MS3.28

### Text on the board
tPlace: bat | en | usb | scl | sda | rst | 3vo | gnd | sck | mo | mi | rx | tx | feather | bat | en | usb | scl | sda | wing | tripler | rst | 3vo | gnd | sck | mo | mi | rx | tx | A | bat | en | usb | scl | sda | rst | 3vo | gnd | sck | mo | mi | rx | tx